# Altium schematic sheet Aux_Power_Bus.SchDoc: Auxiliary 5V & VBAT Busses
size A4; DrawnBy: Samyar Sadat Akhavi; Revision: 1.0; SheetNumber: 7; SheetTotal: 14
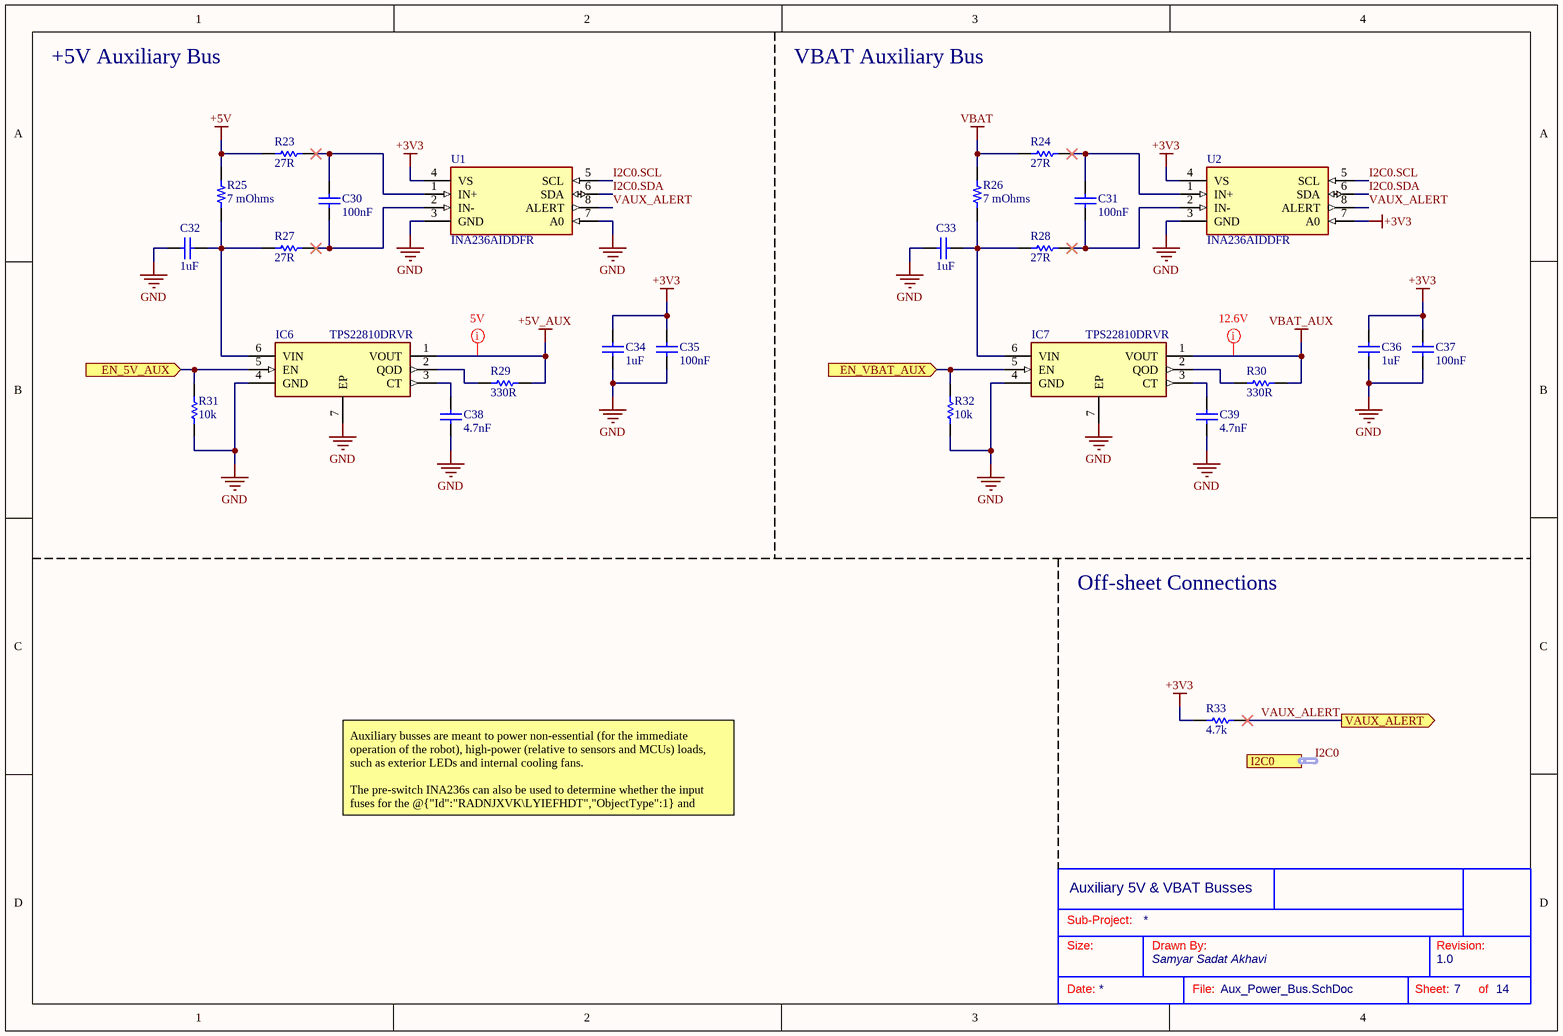
[diagram p0: Aux_Power_Bus.SchDoc]

## Parts
?  (no value)  (graphical)
C30  100nF  [CAP_SMD_603]
C31  100nF  [CAP_SMD_603]
C32  1uF  [CAP_SMD_603]
C33  1uF  [CAP_SMD_603]
C34  1uF  [CAP_SMD_603]
C35  100nF  [CAP_SMD_603]
C36  1uF  [CAP_SMD_603]
C37  100nF  [CAP_SMD_603]
C38  4.7nF  [CAP_SMD_603]
C39  4.7nF  [CAP_SMD_603]
IC6  TPS22810DRVR  [SON65P200X200X80-7N]
IC7  TPS22810DRVR  [SON65P200X200X80-7N]
R23  27R  [RES_0603]
R24  27R  [RES_0603]
R25  7 mOhms  [RES 1206_3216]
R26  7 mOhms  [RES 1206_3216]
R27  27R  [RES_0603]
R28  27R  [RES_0603]
R29  330R  [RES_0603]
R30  330R  [RES_0603]
R31  10k  [RES_0603]
R32  10k  [RES_0603]
R33  4.7k  [RES_0603]
U1  INA236AIDDFR  [SOT23-8_DDF_TEX]
U2  INA236AIDDFR  [SOT23-8_DDF_TEX]

## Ports
EN_5V_AUX (in, see Sensors_IO_Board[3A]), EN_VBAT_AUX (in, see Sensors_IO_Board[3A]), I2C0 (harness I2C, see Sensors_IO_Board[4A], Microcontroller[5C], Sensors_IO[3C], Thermal[4C]), VAUX_ALERT (out, see Sensors_IO_Board[3A], Microcontroller[3C])

## Nets
+3V3: C34.2 C35.1 C36.2 C37.1 R33.1 U1.4(VS) U2.4(VS) U2.7(A0)
+5V: R23.2 R25.2
+5V_AUX: IC6.1(VOUT) R29.1
GND: C32.1 C33.1 C34.1 C35.2 C36.1 C37.2 C38.1 C39.1 IC6.4(GND) IC6.7(EP) IC7.4(GND) IC7.7(EP) R31.2 R32.2 U1.3(GND) U1.7(A0) U2.3(GND)
VBAT: R24.2 R26.2
VBAT_AUX: IC7.1(VOUT) R30.1
EN_5V_AUX: IC6.5(EN) R31.1 ; port EN_5V_AUX
EN_VBAT_AUX: IC7.5(EN) R32.1 ; port EN_VBAT_AUX
I2C0.SCL: U1.5(SCL) U2.5(SCL)
I2C0.SDA: U1.6(SDA) U2.6(SDA)
VAUX_ALERT: R33.2 U1.8(ALERT) U2.8(ALERT) ; port VAUX_ALERT
NetC30_1: C30.1 R23.1 U1.1(IN+)
NetC30_2: C30.2 R27.1 U1.2(IN-)
NetC31_1: C31.1 R24.1 U2.1(IN+)
NetC31_2: C31.2 R28.1 U2.2(IN-)
NetC32_2: C32.2 IC6.6(VIN) R25.1 R27.2
NetC33_2: C33.2 IC7.6(VIN) R26.1 R28.2
NetC38_2: C38.2 IC6.3(CT)
NetC39_2: C39.2 IC7.3(CT)
NetIC6_2: IC6.2(QOD) R29.2
NetIC7_2: IC7.2(QOD) R30.2

## Buses and harness runs
harness I2C0 = port I2C0

## Layout directives
rule Supply Nets [Voltage = 5.000]: +5V_AUX
rule Supply Nets [Voltage = 12.60]: VBAT_AUX

## Notes on the sheet
- +5V Auxiliary Bus
- VBAT Auxiliary Bus
- Off-sheet Connections
- Auxiliary busses are meant to power non-essential (for the immediate operation of the robot), high-power (relative to sensors and MCUs) loads, such as exterior LEDs and internal cooling fans.
  The pre-switch INA236s can also be used to determine whether the input fuses for the @{"Id":"RADNJXVK\LYIEFHDT","ObjectType":1} and @{"Id":"RADNJXVK\DFYGACVF","ObjectType":1} busses have blown or not.
- Sub-Project:
- Size:
- Drawn By:
- Revision:
- Date:
- File:
- Sheet:
- of

## Library data of the parts
? = Standard Title Block
C30 C31 C35 C37-C39 = Non-polar Capacitor: Generic Ceramic Capacitor; Voltage: 6.3V
  C30 C31 C35 C37: Value: 100nF
  C38 C39: Value: 4.7nF
C32 C34 C36 = Non-polar Capacitor: Generic Ceramic Capacitor; Voltage: 16; Value: 1uF
C33 = Non-polar Capacitor: Generic Ceramic Capacitor; Voltage: 16V; Value: 1uF
IC6 IC7 = TPS22810DRVR: Integrated Circuit; Manufacturer_Name: Texas Instruments; Datasheet Link: http://www.ti.com/lit/gpn/tps22810; Height: 0.8mm; Manufacturer_Part_Number: TPS22810DRVR; Mouser Part Number: 595-TPS22810DRVR; Mouser Price/Stock: https://www.mouser.co.uk/ProductDetail/Texas-Instruments/TPS22810DRVR?qs=5aG0NVq1C4wkfnc1%252B6LezA%3D%3D; Arrow Part Number: TPS22810DRVR; Arrow Price/Stock: https://www.arrow.com/en/products/tps22810drvr/texas-instruments?region=nac
R23 R24 R27 R28 R31-R33 = Resistor: Power: 1/8W
  R23 R24 R27 R28: Value: 27R
  R31 R32: Value: 10k
  R33: Value: 4.7k
R25 R26 = TLR2B10DR007FTDG: RES 0.007 OHM 1% 1W 1206; Manufacturer: TE Connectivity Passive Product; Temperature Coefficient: ±50ppm/°C; Part Number: TLR2B10DR007FTDG; ComponentLink1Description: Datasheet; ComponentLink1URL: https://www.te.com/commerce/DocumentDelivery/DDEController?Action=srchrtrv&DocNm=1773449-3&DocType=DS&DocLang=English; ComponentLink2Description: DigiKey Link; ComponentLink2URL: https://www.digikey.com/en/products/detail/te-connectivity-passive-product/TLR2B10DR007FTDG/5584869; Composition: Metal Foil; Device Package: 1206 (3216 Metric); Features: Current Sense; Height - Seated (Max): 0.024" (0.60mm); LastUpdated: 2/9/2024 8:54:43 PM; Lifecycle Status: Active; Minimum Order: 1; Number of Terminations: 2; Operating Temperature: -55°C ~ 170°C; Package / Case: 1206 (3216 Metric); Packaging: TapeAndReel; PartId: 27144; Part Status: Active; Power (Watts): 1W; Price: 0.31; Resistance: 7 mOhms; Series: TLR, CGS; Size / Dimension: 0.126" L x 0.063" W (3.20mm x 1.60mm); Supplier 1: DigiKey; Supplier Part Number 1: A131747CT-ND; Supplier Device Package: 1206; Tolerance: ±1%; Value: 7 mOhms
R29 R30 = Resistor: Power: 1/4W; Value: 330R
U1 U2 = INA236AIDDFR: 48-V, 16-bit ultraprecise IÂ²C output digital power monitor with alert in WCSP 8-SOT-23-THIN -40 to 125; Manufacturer_Name: Texas Instruments; Type: Power Management; Copyright: Copyright (C) 2025 Ultra Librarian. All rights reserved.; Manufacturer_Part_Number: INA236AIDDFR; RefDes: RefDes